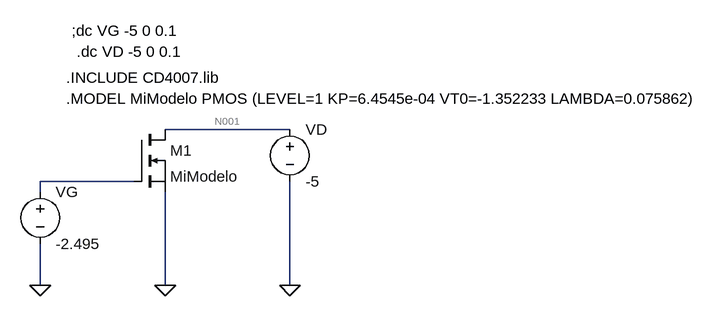
[diagram p0: schematic MiModelo_P_500mua.asc]
MiModelo_P_500mua.asc, the LTspice schematic file:
Version 4
SHEET 1 1364 680
WIRE 416 128 224 128
WIRE 176 208 32 208
WIRE 32 224 32 208
WIRE 32 368 32 304
WIRE 224 368 224 224
WIRE 416 368 416 208
FLAG 32 368 0
FLAG 224 368 0
FLAG 416 368 0
SYMBOL nmos 176 128 R0
SYMATTR InstName M1
SYMATTR Value MiModelo
SYMBOL voltage 32 208 R0
SYMATTR InstName VG
SYMATTR Value -2.495
SYMBOL voltage 416 112 R0
SYMATTR InstName VD
SYMATTR Value -5
TEXT 72 48 Left 2 !.INCLUDE CD4007.lib
TEXT 80 -24 Left 2 !;dc VG -5 0 0.1
TEXT 88 8 Left 2 !.dc VD -5 0 0.1
TEXT 72 80 Left 2 !.MODEL MiModelo PMOS (LEVEL=1 KP=6.4545e-04 VT0=-1.352233 LAMBDA=0.075862)

The netlist it stands for:
* MiModelo_P_500mua.asc
M1 N001 N002 0 0 MiModelo
VG N002 0 -2.495
VD N001 0 -5
.model NMOS NMOS
.model PMOS PMOS
.lib standard.mos
.INCLUDE CD4007.lib
;dc VG -5 0 0.1
.dc VD -5 0 0.1
.MODEL MiModelo PMOS (LEVEL=1 KP=6.4545e-04 VT0=-1.352233 LAMBDA=0.075862)
.backanno
.end

* Results of the author's LTspice run, read from the files saved beside the schematic
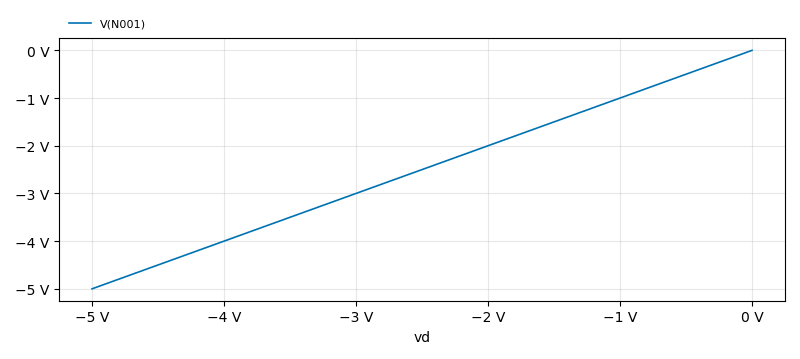
[diagram p1: DC transfer characteristic of MiModelo_P_500mua.asc, plotted from the saved traces]
* DC transfer characteristic, 1 run:
*   V(N001): -5 V at vd=-5 V, 0 V at vd=0 V, min -5 V, max 0 V